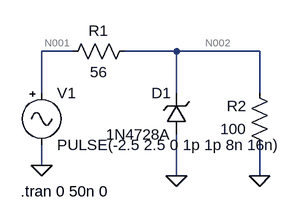
[diagram p0: schematic regulador_3V3.asc]
regulador_3V3.asc, the LTspice schematic file:
Version 4
SHEET 1 880 680
WIRE 32 96 -16 96
WIRE 192 96 112 96
WIRE 320 96 192 96
WIRE -16 160 -16 96
WIRE 192 160 192 96
WIRE 320 160 320 96
WIRE -16 272 -16 240
WIRE 192 288 192 224
WIRE 320 288 320 240
FLAG 192 288 0
FLAG 320 288 0
FLAG -16 272 0
SYMBOL res 128 80 R90
WINDOW 0 0 56 VBottom 2
WINDOW 3 32 56 VTop 2
SYMATTR InstName R1
SYMATTR Value 56
SYMBOL res 336 256 R180
WINDOW 0 36 76 Left 2
WINDOW 3 36 40 Left 2
SYMATTR InstName R2
SYMATTR Value 100
SYMBOL zener 208 224 R180
WINDOW 0 24 64 Left 2
WINDOW 3 24 0 Left 2
SYMATTR InstName D1
SYMATTR Value 1N4728A
SYMBOL Misc\\signal -16 144 R0
WINDOW 123 0 0 Left 2
WINDOW 39 0 0 Left 2
SYMATTR InstName V1
SYMATTR Value PULSE(-2.5 2.5 0 1p 1p 8n 16n)
TEXT -48 312 Left 2 !.tran 0 50n 0

The netlist it stands for:
* regulador_3V3.asc
R1 N002 N001 56
R2 0 N002 100
D1 0 N002 1N4728A
V1 N001 0 PULSE(-2.5 2.5 0 1p 1p 8n 16n)
.model D D
.lib standard.dio
.tran 0 50n 0
.backanno
.end

* Results of the author's LTspice run, read from the files saved beside the schematic
* Operating Point, zero values left out:
*   V(n002) = -737.4 mV
*   V(n001) = -2.5 V
*   I(D1) = 24.1 mA
*   I(R2) = 7.374 mA
*   I(R1) = 31.47 mA
*   I(V1) = 31.47 mA
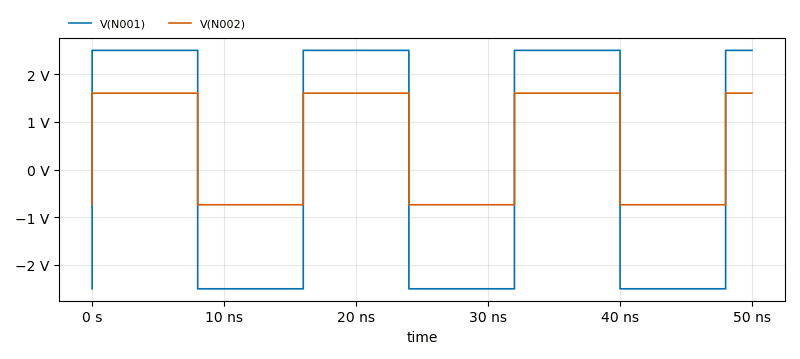
[diagram p1: Transient Analysis of regulador_3V3.asc, plotted from the saved traces]
* Transient Analysis, 1 run:
*   V(N001): min -2.5 V, max 2.5 V, average 100.2 mV, rms 2.5 V, last 2.5 V
*   V(N002): min -737.4 mV, max 1.603 V, average 479.5 mV, rms 1.264 V, last 1.603 V